# EAGLE design circuit (EAGLE 9.6.2)
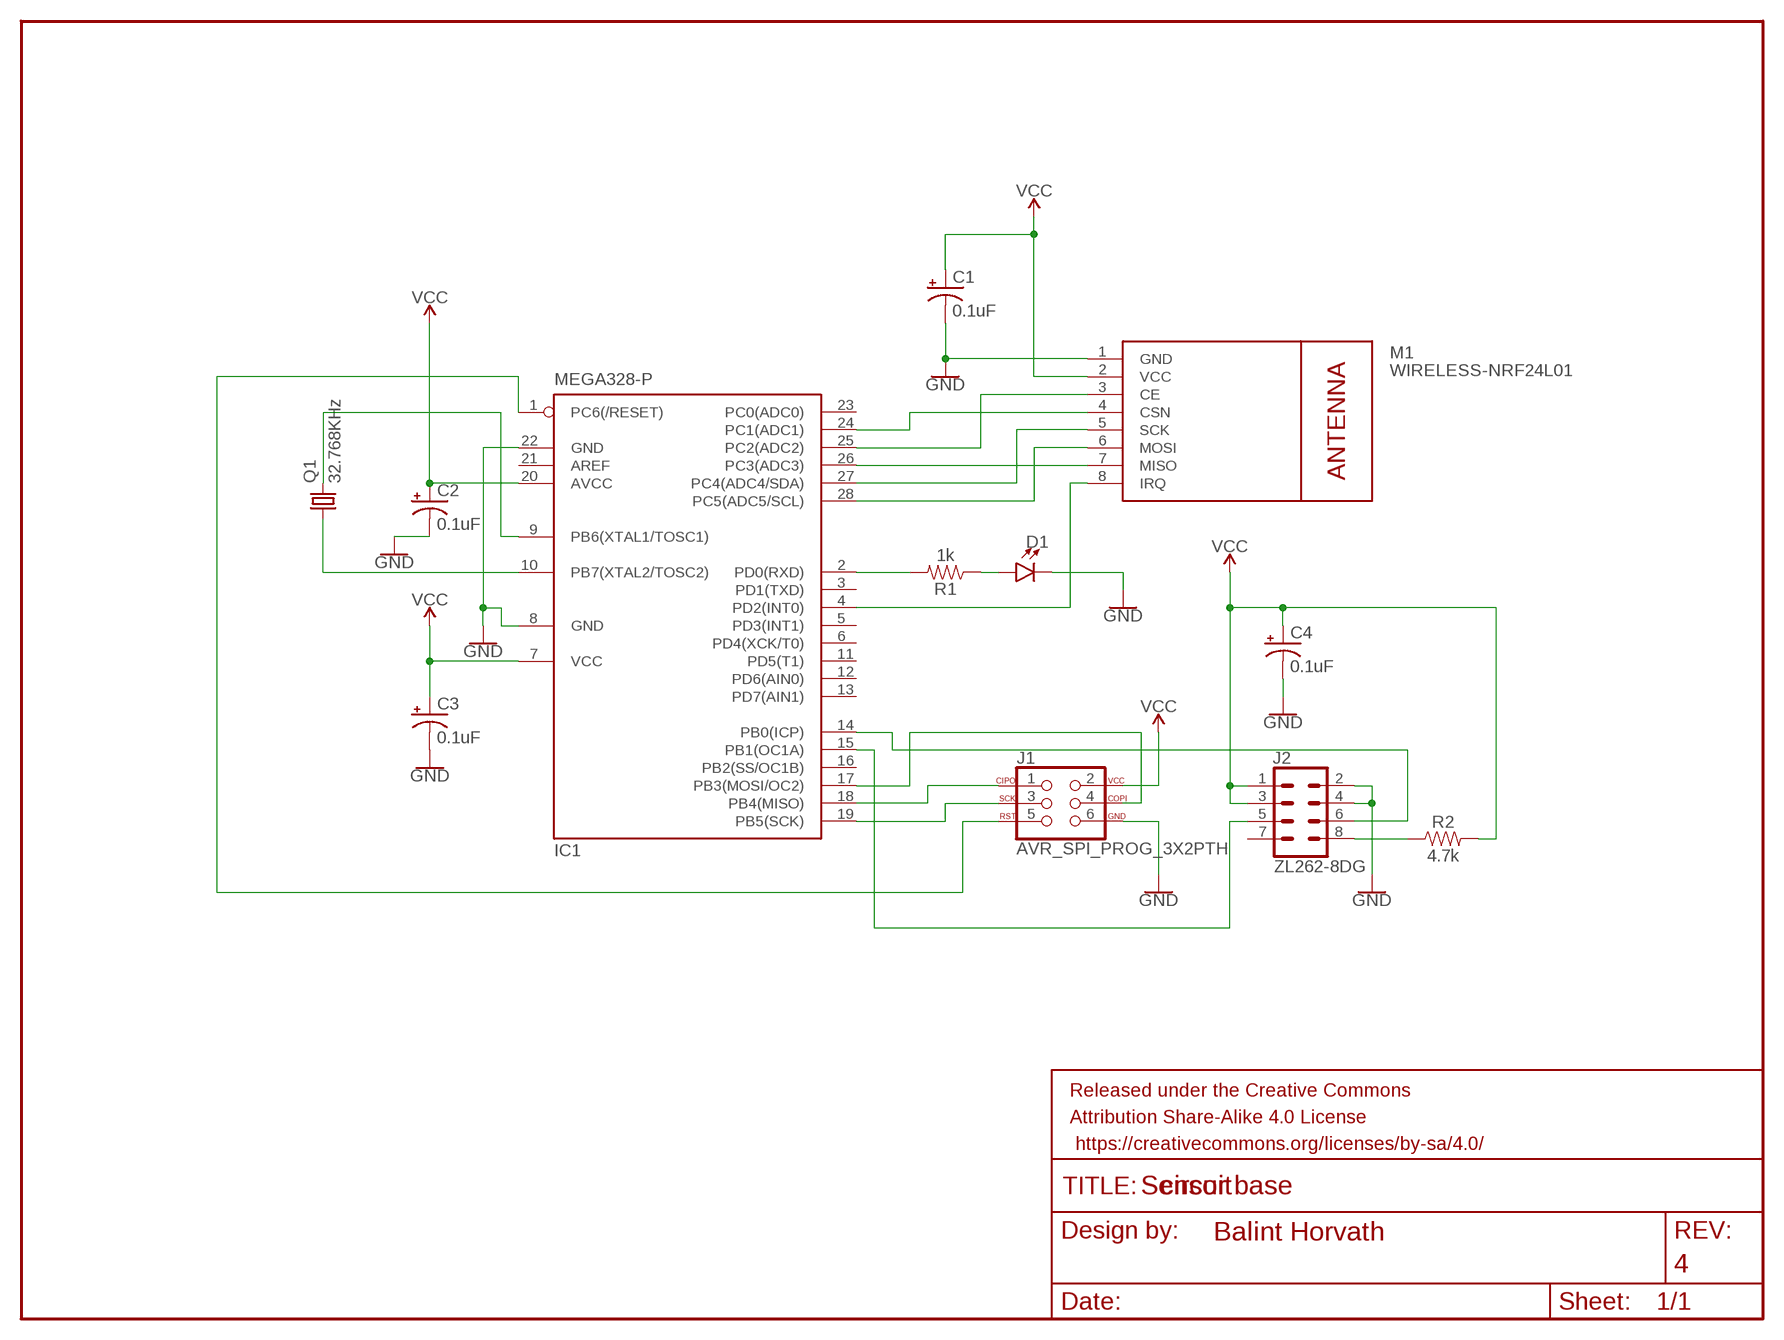
[diagram p0: schematic, sheet 1]

## Parts
C1  0.1uF  0.1UF-POLAR-RADIAL-2.5MM-25V-20%  [CPOL-RADIAL-2.5MM-5MM]
C2  0.1uF  0.1UF-POLAR-RADIAL-2.5MM-25V-20%  [CPOL-RADIAL-2.5MM-5MM]
C3  0.1uF  0.1UF-POLAR-RADIAL-2.5MM-25V-20%  [CPOL-RADIAL-2.5MM-5MM]
C4  0.1uF  0.1UF-POLAR-RADIAL-2.5MM-25V-20%  [CPOL-RADIAL-2.5MM-5MM]
D1  LED5MM  [LED_5MM]
FRAME1  FRAME-LETTER  [CREATIVE_COMMONS]
IC1  MEGA328-P  MEGA8-P  [DIL28-3]
J1  AVR_SPI_PROG_3X2PTH  [2X3]
J2  ZL262-8DG  CONN_04X2  [2X4]
M1  WIRELESS-NRF24L01  [WIRELESS-NRF24L01]
Q1  32.768KHz  CRYSTALTC26V  [TC26V]
R1  1k  1KOHM-HORIZ-1/4W-1%  [AXIAL-0.3]
R2  4.7k  1KOHM-HORIZ-1/4W-1%  [AXIAL-0.3]

## Nets
GND: C1.2(-) C2.2(-) C3.2(-) C4.2(-) D1.K(C) IC1.8(GND) IC1.22(GND) J1.6 J2.2 J2.4 M1.1(GND)
N$1: IC1.9(PB6(XTAL1/TOSC1)) Q1.2
N$2: IC1.10(PB7(XTAL2/TOSC2)) Q1.1
N$3: IC1.2(PD0(RXD)) R1.P$2
N$4: D1.A R1.P$1
N$5: IC1.27(PC4(ADC4/SDA)) M1.5(SCK)
N$6: IC1.4(PD2(INT0)) M1.8(IRQ)
N$7: IC1.24(PC1(ADC1)) M1.4(CSN)
N$8: IC1.26(PC3(ADC3)) M1.7(MISO)
N$9: IC1.25(PC2(ADC2)) M1.3(CE)
N$10: IC1.28(PC5(ADC5/SCL)) M1.6(MOSI)
N$11: IC1.19(PB5(SCK)) J1.3
N$12: IC1.18(PB4(MISO)) J1.1
N$13: IC1.1(PC6(/RESET)) J1.5
N$14: IC1.17(PB3(MOSI/OC2)) J1.4
N$15: IC1.15(PB1(OC1A)) J2.5
N$16: J2.8 R2.P$1
N$17: IC1.14(PB0(ICP)) J2.6
VCC: C1.1(+) C2.1(+) C3.1(+) C4.1(+) IC1.7(VCC) IC1.20(AVCC) J1.2 J2.1 J2.3 M1.2(VCC) R2.P$2
Unconnected: IC1.3(PD1(TXD)) IC1.5(PD3(INT1)) IC1.6(PD4(XCK/T0)) IC1.11(PD5(T1)) IC1.12(PD6(AIN0)) IC1.13(PD7(AIN1)) IC1.16(PB2(SS/OC1B)) IC1.21(AREF) IC1.23(PC0(ADC0)) J2.7

## Notes on the sheet
- Sensor base

## Library data of the parts
C1-C4 = SparkFun-Capacitors:0.1UF-POLAR: 0.1µF polarized capacitors A capacitor is a passive two-terminal electrical component used to store electrical energy temporarily in an electric field.; PROD_ID: CAP-xxx
D1 = SparkFun-LED:LED: LED (Generic) Standard schematic elements and footprints for 5mm, 3mm, 1206, and 0603 sized LEDs. Generic LEDs with no color specified.
FRAME1 = SparkFun-Aesthetics:FRAME-LETTER: Schematic Frame - Letter Standard 8.5x11 US Letter frame; DESIGNER: Balint Horvath; REV: 4
IC1 = atmel:MEGA8-P: MICROCONTROLLER 8 Kbytes FLASH, 1 kbytes SRAM, 512 bytes EEPROM, USART, 4-channel 10 bit ADC, 2-channel 8 bit ADC Pin compatible with Atmega48, ATMega88, ATMega168 Source: avr.lbr; OC_FARNELL: unknown; OC_NEWARK: unknown
J1 = SparkFun-Connectors:AVR_SPI_PROG_3X2: AVR ISP 6 Pin This is the reduced ISP connector for AVR programming. Common on Arduino. This footprint will take up less PCB space and can be used with a 10-pin to 6-pin adapter such as SKU: BOB-08508 **Special note about "TEST_POINT" package. The stop mask is on the top side, so if you want your programming test points to be on the bottom of your board, make sure to place this package on the bottom side of the board. This also ensure that the orientation to program from the bottom side will be correct. SparkFun Products: SparkFun ISP Pogo Adapter <https://www.sparkfun.com/products/11591> - NS Tiny AVR Programmer <https://www.sparkfun.com/products/11801> -PTH
J2 = SparkFun-Connectors:CONN_04X2: Multi connection point. Often used as Generic Header-pin footprint for 0.1 inch spaced/style header connections On any of the 0.1 inch spaced packages, you can populate with these: Break Away Headers - Straight <https://www.sparkfun.com/products/116> (PRT-00116) Break Away Male Headers - Right Angle <https://www.sparkfun.com/products/553> (PRT-00553) Female Headers <https://www.sparkfun.com/products/115> (PRT-00115) Break Away Headers - Machine Pin <https://www.sparkfun.com/products/117> (PRT-00117) Break Away Female Headers - Swiss Machine Pin <https://www.sparkfun.com/products/743> (PRT-00743)
M1 = diy-modules:WIRELESS-NRF24L01: 2.4 GHz Wireless Module based on NRF24L01 chip More details available here: http://www.electrodragon.com/w/NRF24L01 Click here to find device on ebay.com <http://www.ebay.com/sch/nrf24l01+arduino>
Q1 = crystal:CRYSTAL: CRYSTAL; OC_FARNELL: unknown; OC_NEWARK: unknown
R1 = SparkFun-Resistors:1KOHM: 1kΩ resistor A resistor is a passive two-terminal electrical component that implements electrical resistance as a circuit element. Resistors act to reduce current flow, and, at the same time, act to lower voltage levels within circuits. - Wikipedia; PROD_ID: RES-12182
R2 = Balint-components:1KOHM: 4.7kΩ resistor A resistor is a passive two-terminal electrical component that implements electrical resistance as a circuit element. Resistors act to reduce current flow, and, at the same time, act to lower voltage levels within circuits. - Wikipedia; PROD_ID: B-00001

## Board
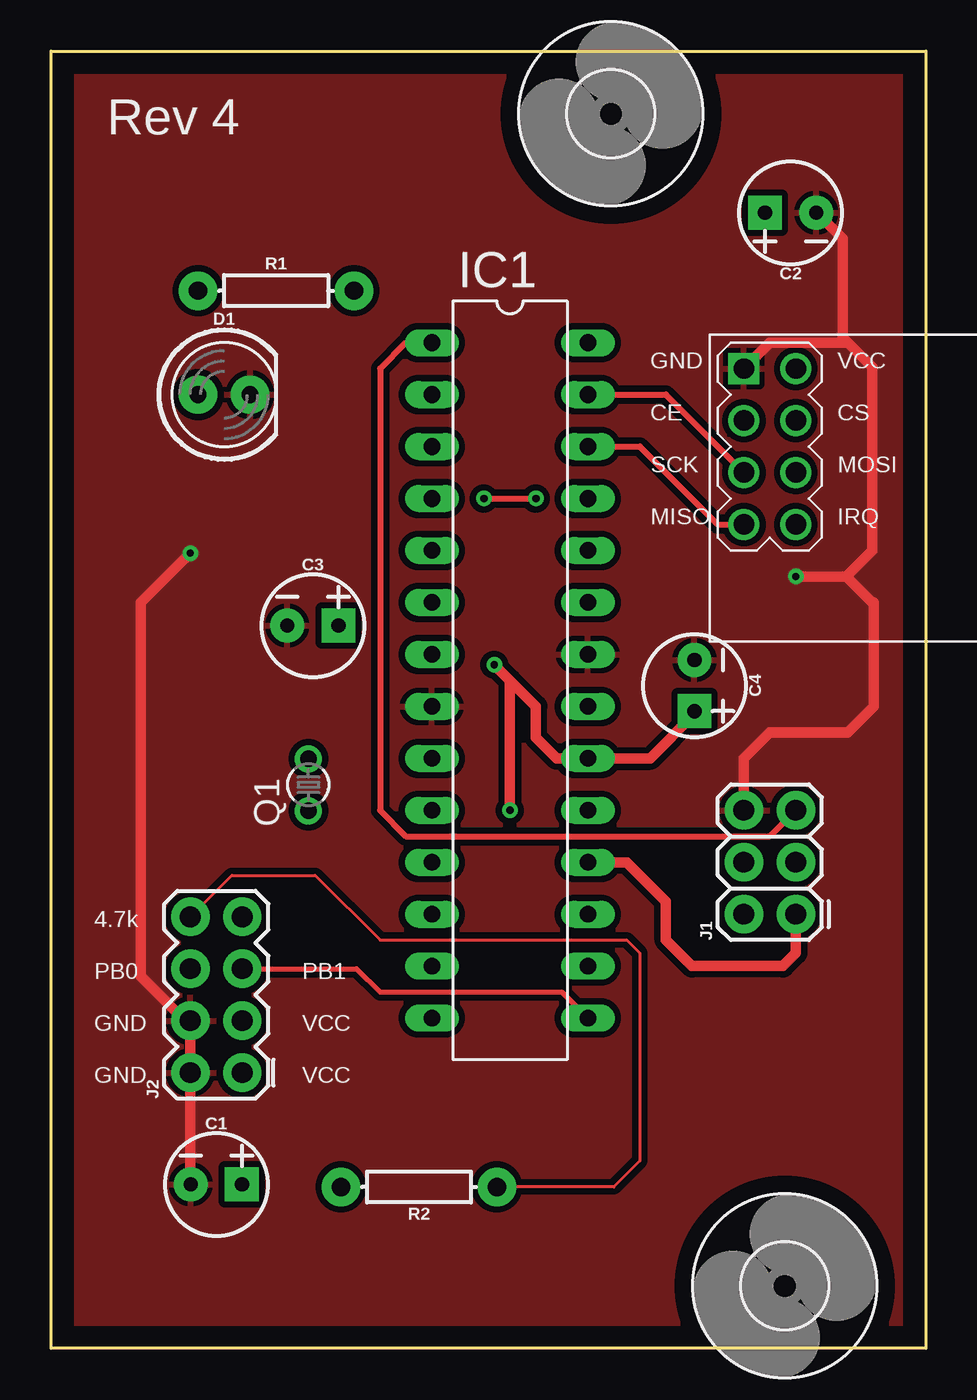
[diagram p1: board, top side]
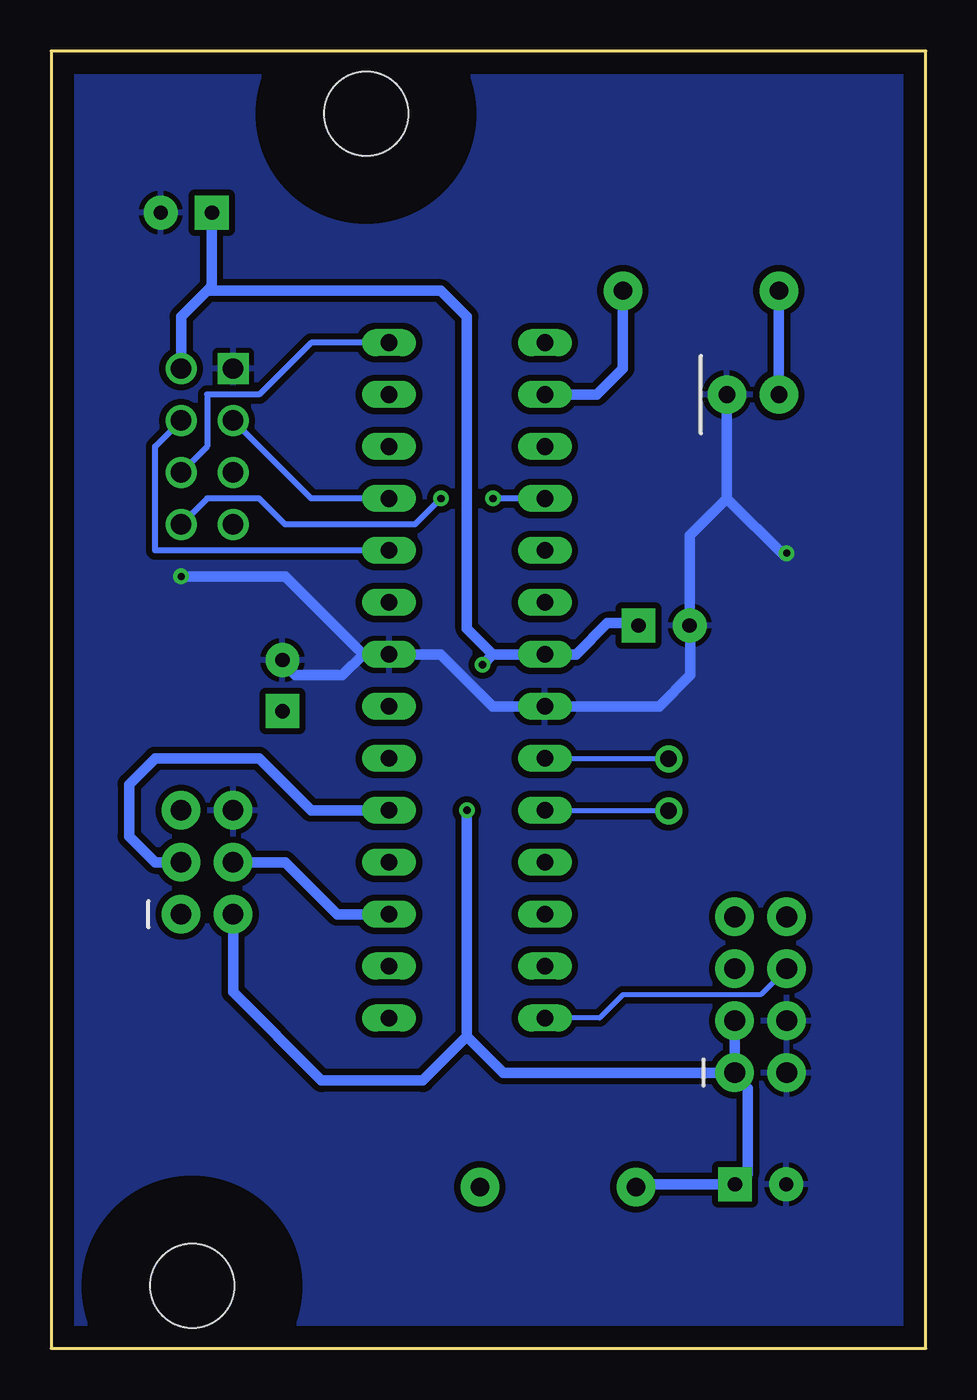
[diagram p2: board, bottom side, seen from below]

Size 42.74 x 63.41 mm. Coordinates in mm from the lower left corner, seen from the top.
Outline: 0,63.41 42.74,63.41 42.74,0 0,0 0,63.41
Copper layers (1*16): Top 0.035mm / dielectric 1.5mm / Bottom 0.035mm
Design rules "default": minimum track width 6mil, minimum drill 0.35mm, track to track 6mil, track to pad 6mil, pad to pad 6mil, via to via 6mil, smd to smd 6mil, copper to edge 40mil, drill to drill 6mil, minimum pad ring 10mil, minimum via ring 8mil, stop-mask expansion 4mil, vias tented up to drill 0mil, thermal gap 10mil

### Footprints (pad centres in the part's own frame; a part is rotated, then mirrored left to right if it is on the bottom)
CPOL-RADIAL-2.5MM-5MM = drill 0.7 pad 1.651 square: 1 1.25,0 | drill 0.7 pad 1.651: 2 -1.25,0
LED_5MM = drill 0.813 pad 1.88: A -1.27,0; K 1.27,0
DIL28-3 = drill 0.813 long: 1 -16.51,-3.81; 2 -13.97,-3.81; 3 -11.43,-3.81; 4 -8.89,-3.81; 5 -6.35,-3.81; 6 -3.81,-3.81; 7 -1.27,-3.81; 8 1.27,-3.81; 9 3.81,-3.81; 10 6.35,-3.81; 11 8.89,-3.81; 12 11.43,-3.81; 13 13.97,-3.81; 14 16.51,-3.81; 15 16.51,3.81; 16 13.97,3.81; 17 11.43,3.81; 18 8.89,3.81; 19 6.35,3.81; 20 3.81,3.81; 21 1.27,3.81; 22 -1.27,3.81; 23 -3.81,3.81; 24 -6.35,3.81; 25 -8.89,3.81; 26 -11.43,3.81; 27 -13.97,3.81; 28 -16.51,3.81
2X3 = drill 1.016 pad 1.88: 1 0,0; 2 0,2.54; 3 2.54,0; 4 2.54,2.54; 5 5.08,0; 6 5.08,2.54
2X4 = drill 1.016 pad 1.88: 1 -3.81,-1.27; 2 -3.81,1.27; 3 -1.27,-1.27; 4 -1.27,1.27; 5 1.27,-1.27; 6 1.27,1.27; 7 3.81,-1.27; 8 3.81,1.27
WIRELESS-NRF24L01 = drill 1 square: 1 -12.7,6.35 | drill 1: 2 -10.16,6.35; 3 -12.7,3.81; 4 -10.16,3.81; 5 -12.7,1.27; 6 -10.16,1.27; 7 -12.7,-1.27; 8 -10.16,-1.27
TC26V = drill 0.813: 1 -1.27,0; 2 1.27,0
AXIAL-0.3 = drill 0.9 pad 1.88: P$1 -3.81,0; P$2 3.81,0
4,1 = hole 4.1: 0,0

### Placement (x,y rotation side)
C1  8.07,8.02 0 top
C2  36.14,55.52 180 top
C3  12.79,35.34 0 top
C4  31.44,32.4 270 top
D1  8.45,46.62 0 top
FRAME1  33.22,-22.59 0 top  (outside the outline)
IC1  22.42,32.66 270 top
J1  36.39,21.23 90 top
J2  8.07,17.29 90 top
M1  46.55,41.55 0 top
Q1  12.57,27.55 90 top
R1  10.99,51.7 0 top
R2  17.98,7.89 180 top
U$1  [4,1]  35.85,3.05 0 top
U$2  [4,1]  27.35,60.35 0 top

### Tracks (layer width: path | path; a pad name or v marks a point on that pad's centre or on a via)
GND  (via drill 0.35)
  Top 0.508: 38.85,37.73 40.12,39.01 40.12,47.97 38.93,49.16 | 38.93,49.16 35.12,49.16 M1.1 | v36.39,37.73 38.85,37.73 | 38.85,37.73 40.12,36.46 40.2,36.46 40.2,31.38 38.93,30.12 35.12,30.12 33.85,28.84 J1.6 | C1.2 6.8,8.04 J2.2 J2.4 6.55,16.02 4.39,18.18 4.39,36.46 v6.8,38.88 | 38.93,49.16 38.68,49.42 38.68,54.24 37.41,55.52 C2.2
  Bottom 0.406: 11.5,35.29 C3.2
  Bottom 0.508: 27.5,33.92 31.31,37.73 v36.39,37.73 | 11.5,35.29 11.5,32.91 13.02,31.38 IC1.8 21.15,31.38 23.69,33.92 IC1.22 27.5,33.92 | C3.2 11.54,39.73 9.72,41.55 | D1.K 9.72,41.55 | 9.72,41.55 6.93,38.75 v6.8,38.88 | 27.5,33.92 28.52,32.91 30.8,32.91 31.44,33.54 C4.2 | C1.2 7.18,7.66
  pour Bottom (isolate 0.305): 0.83,62.5 42.1,62.5 42.1,0.9 0.83,0.9
  pour Top (isolate 0.305): 0.83,62.5 41.47,62.5 41.47,0.9 0.83,0.9
N$1
  Bottom 0.254: Q1.2 18.59,28.82 IC1.9
N$2
  Bottom 0.254: Q1.1 18.59,26.28 IC1.10
N$3
  Bottom 0.508: IC1.2 16.07,46.62 14.8,47.9 R1.P$2
N$4
  Bottom 0.508: R1.P$1 D1.A
N$5
  Top 0.305: IC1.27 30.04,46.62 M1.5
N$6  (via drill 0.35)
  Top 0.305: v21.15,41.55 v23.69,41.55
  Bottom 0.305: IC1.4 v21.15,41.55 | v23.69,41.55 24.96,40.27 31.31,40.27 32.58,41.55 35.12,41.55 M1.8
N$7
  Bottom 0.305: IC1.24 37.66,39.01 37.66,44.09 M1.4
N$8
  Top 0.305: IC1.26 28.77,44.09 32.58,40.27 M1.7
N$9
  Bottom 0.305: IC1.25 30.04,41.55 M1.3
N$10
  Bottom 0.305: IC1.28 30.04,49.16 32.58,46.62 35.12,46.62 35.12,44.09 M1.6
N$11
  Bottom 0.508: IC1.19 30.04,26.3 32.58,28.84 37.66,28.84 38.93,27.58 38.93,25.04 37.66,23.77 J1.3
N$12
  Top 0.508: J1.1 36.39,19.32 35.76,18.68 31.31,18.68 30.04,19.95 30.04,21.86 28.13,23.77 IC1.18
N$13
  Top 0.305: IC1.1 17.34,49.16 16.07,47.9 16.07,26.3 17.34,25.04 35.12,25.04 J1.5
N$14
  Bottom 0.508: IC1.17 28.77,21.23 31.31,23.77 J1.4
N$15
  Top 0.254: J2.5 14.93,18.56 16.07,17.41 24.96,17.41 IC1.15
N$16
  Top 0.152: J2.8 8.83,23.13 12.9,23.13 16.07,19.95 28.13,19.95 28.77,19.32 28.77,9.16 27.5,7.89 R2.P$1
N$17
  Bottom 0.254: J2.6 8.07,17.29 14.8,17.29 15.94,16.14 IC1.14
VCC  (via drill 0.35)
  Top 0.508: v21.66,33.42 22.42,32.66 | 22.42,32.66 v22.42,26.3 | 22.42,32.66 23.69,31.38 23.69,29.86 24.71,28.84 IC1.20 29.28,28.84 31.44,31 C4.1
  Bottom 0.508: 21.15,33.92 22.42,35.2 22.42,50.44 23.69,51.7 35.12,51.7 | 35.12,51.7 36.39,50.44 M1.2 | J1.2 33.85,17.41 29.53,13.1 24.58,13.1 22.42,15.26 | J2.1 J2.3 | C3.1 14.15,35.45 15.56,35.45 17.09,33.92 IC1.7 21.15,33.92 | 21.15,33.92 v21.66,33.42 | v22.42,26.3 22.42,15.26 | 9.34,8.04 C1.1 | 35.12,51.7 34.89,51.94 C2.1 | C1.1 14.04,8.02 R2.P$2 | 22.42,15.26 20.64,13.48 J2.1 | J2.1 9.34,13.35 8.7,12.72 8.7,8.53 9.21,8.02 C1.1

### Text on the board
tNames: Rev 4 | GND | VCC | CE | CS | SCK | MOSI | MISO | IRQ | 4.7k | PB0 | PB1 | GND | VCC | GND | VCC